# EAGLE design arpie2_display (EAGLE 6.6.0)
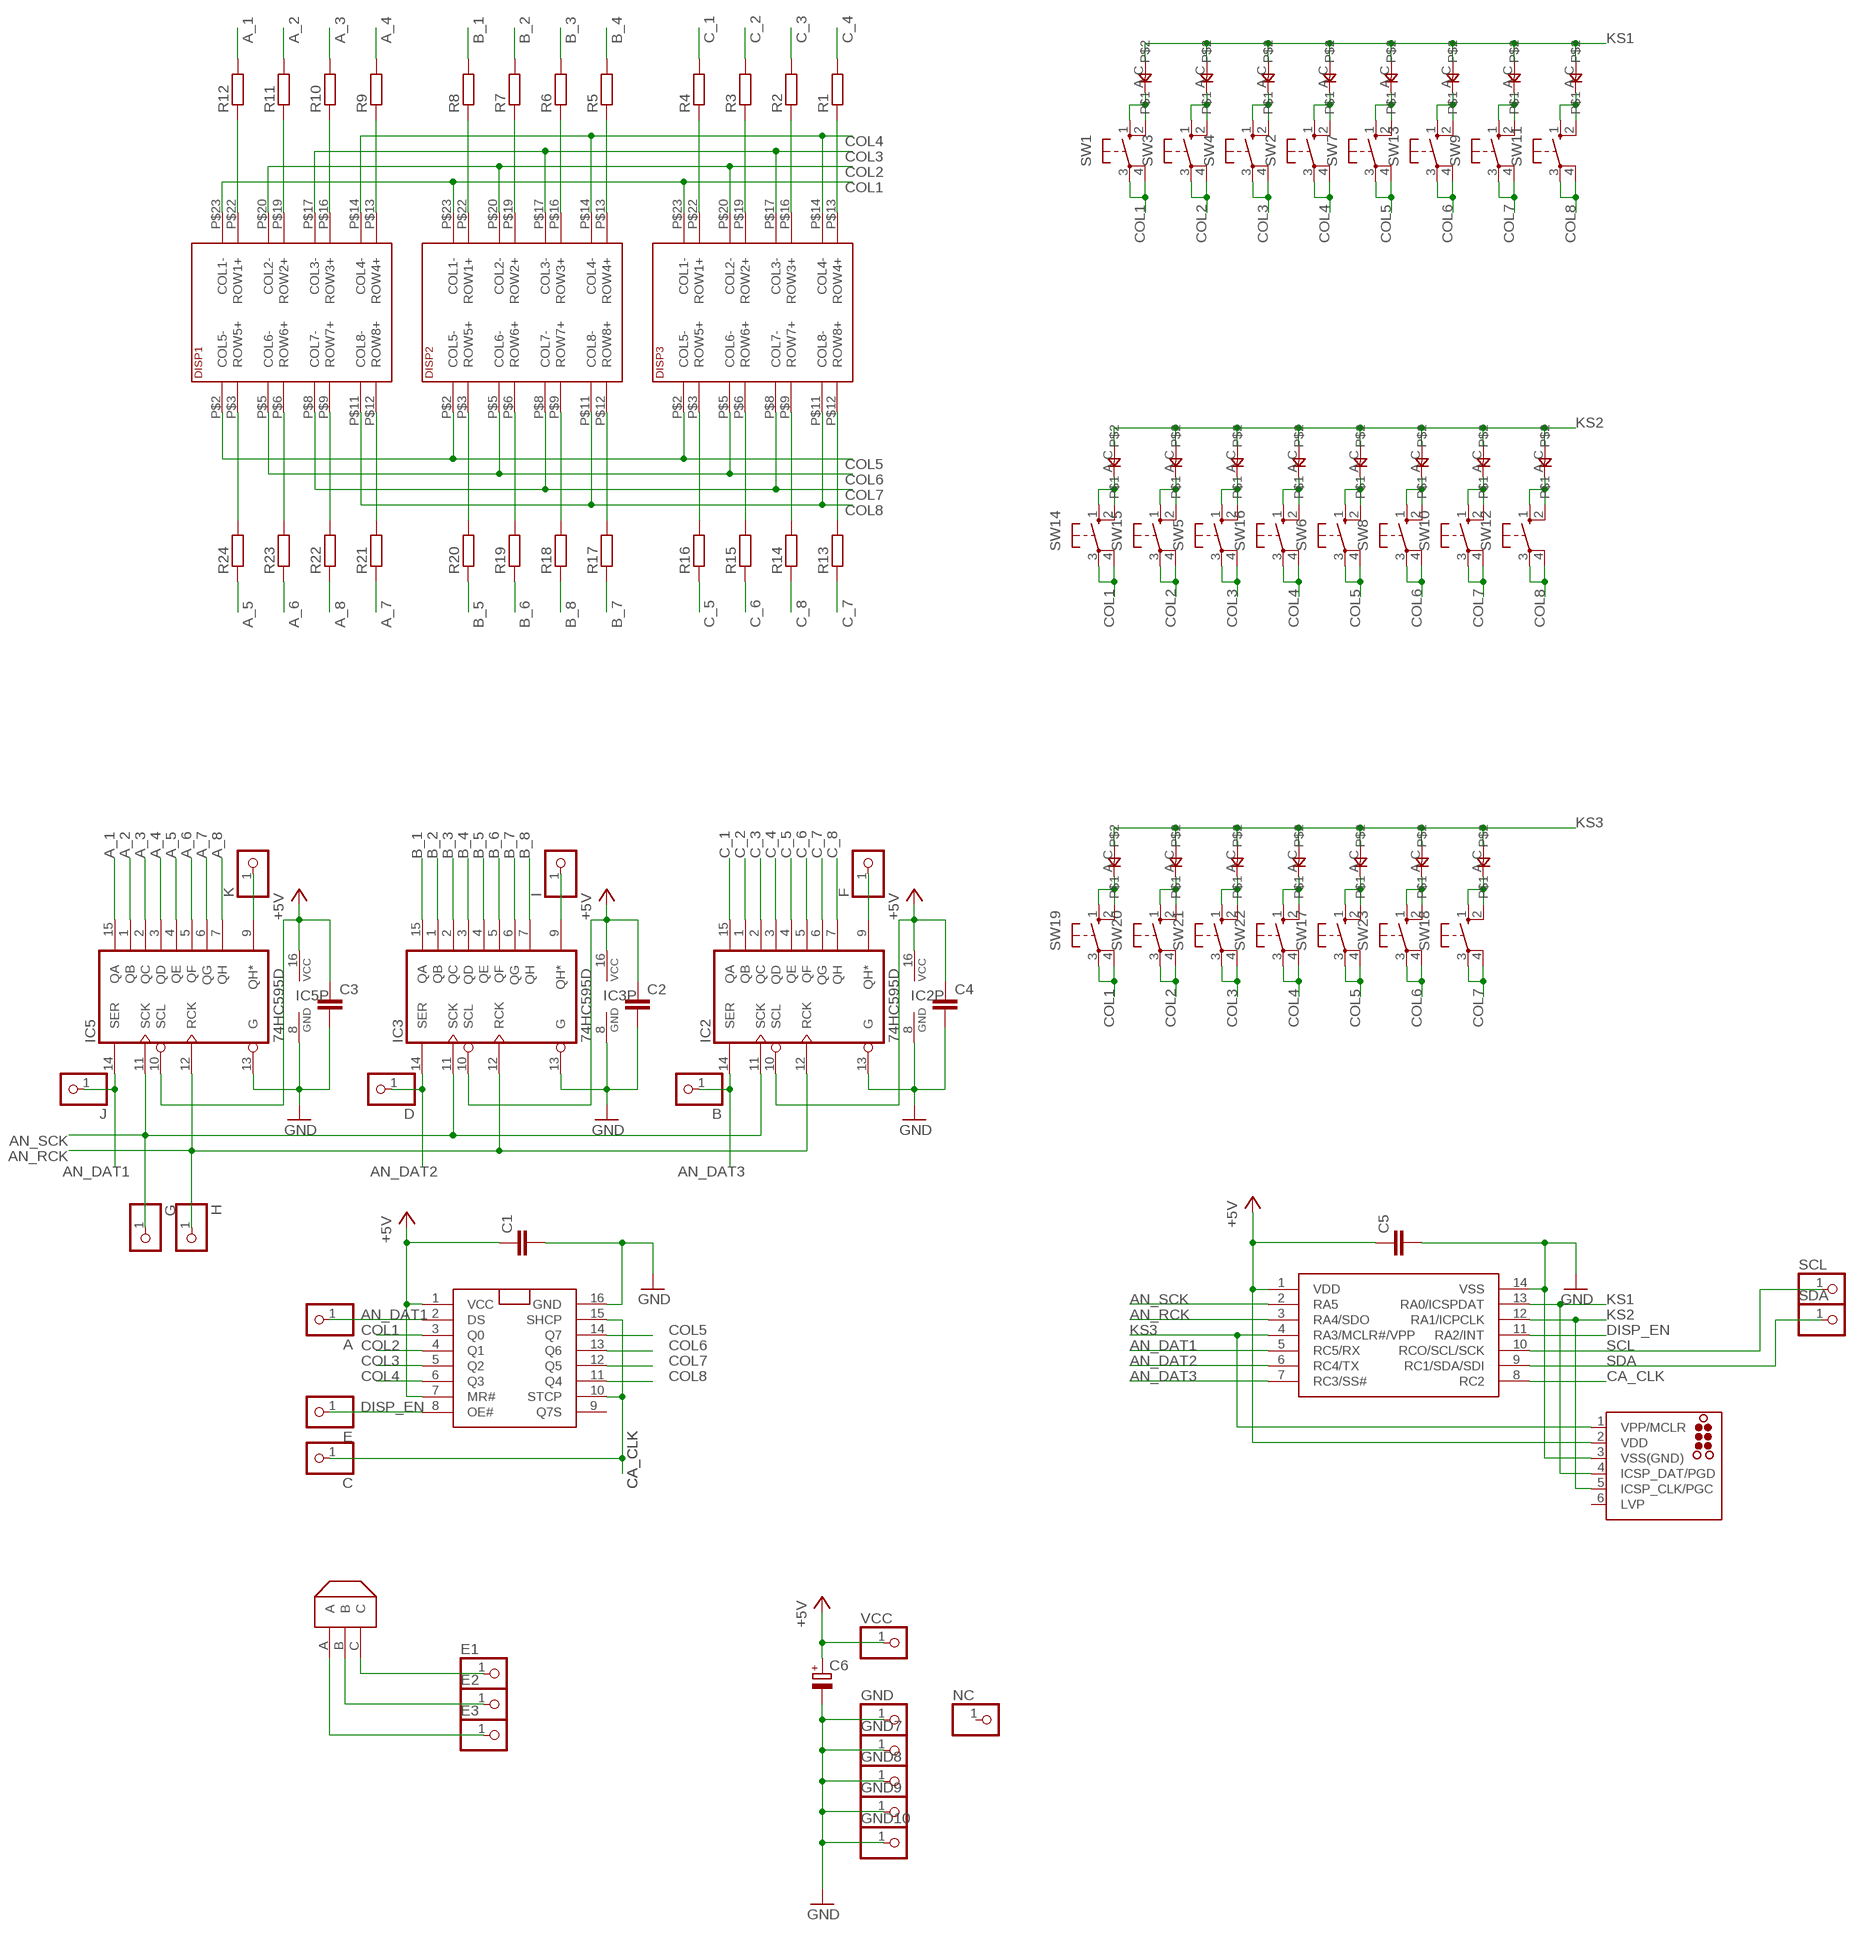
[diagram p0: schematic, sheet 1]

## Parts
A  PINHD-1X1  [1X01]
B  PINHD-1X1  [1X01]
C  PINHD-1X1  [1X01]
C1  C-EUC0805  [C0805]
C2  C-EUC0805  [C0805]
C3  C-EUC0805  [C0805]
C4  C-EUC0805  [C0805]
C5  C-EUC0805  [C0805]
C6  CPOL-EUE2,5-6E  [E2,5-6E]
D  PINHD-1X1  [1X01]
DISP1  1388BBMATRIX  [1388LEDMATRIX]
DISP2  1388BBMATRIX  [1388LEDMATRIX]
DISP3  1388BBMATRIX  [1388LEDMATRIX]
E  PINHD-1X1  [1X01]
E1  PINHD-1X1  [1X01]
E2  PINHD-1X1  [1X01]
E3  PINHD-1X1  [1X01]
ENC1  ENCODER  [ENCODER]
F  PINHD-1X1  [1X01]
G  PINHD-1X1  [1X01]
GND  PINHD-1X1  [1X01]
GND7  PINHD-1X1  [1X01]
GND8  PINHD-1X1  [1X01]
GND9  PINHD-1X1  [1X01]
GND10  PINHD-1X1  [1X01]
H  PINHD-1X1  [1X01]
I  PINHD-1X1  [1X01]
IC1  PIC16F1825SO14  [SO14]
IC2  74HC595D  [SO16]
IC3  74HC595D  [SO16]
IC4  NPIC6C596  [SO16]
IC5  74HC595D  [SO16]
ICSP  TC2030-MCP-NL  [TC2030-MCP-NL]
J  PINHD-1X1  [1X01]
K  PINHD-1X1  [1X01]
NC  PINHD-1X1  [1X01]
R1  R-EU_R0805  [R0805]
R2  R-EU_R0805  [R0805]
R3  R-EU_R0805  [R0805]
R4  R-EU_R0805  [R0805]
R5  R-EU_R0805  [R0805]
R6  R-EU_R0805  [R0805]
R7  R-EU_R0805  [R0805]
R8  R-EU_R0805  [R0805]
R9  R-EU_R0805  [R0805]
R10  R-EU_R0805  [R0805]
R11  R-EU_R0805  [R0805]
R12  R-EU_R0805  [R0805]
R13  R-EU_R0805  [R0805]
R14  R-EU_R0805  [R0805]
R15  R-EU_R0805  [R0805]
R16  R-EU_R0805  [R0805]
R17  R-EU_R0805  [R0805]
R18  R-EU_R0805  [R0805]
R19  R-EU_R0805  [R0805]
R20  R-EU_R0805  [R0805]
R21  R-EU_R0805  [R0805]
R22  R-EU_R0805  [R0805]
R23  R-EU_R0805  [R0805]
R24  R-EU_R0805  [R0805]
SCL  PINHD-1X1  [1X01]
SDA  PINHD-1X1  [1X01]
SW1  10-XX  [B3F-10XX]
SW2  10-XX  [B3F-10XX]
SW3  10-XX  [B3F-10XX]
SW4  10-XX  [B3F-10XX]
SW5  10-XX  [B3F-10XX]
SW6  10-XX  [B3F-10XX]
SW7  10-XX  [B3F-10XX]
SW8  10-XX  [B3F-10XX]
SW9  10-XX  [B3F-10XX]
SW10  10-XX  [B3F-10XX]
SW11  10-XX  [B3F-10XX]
SW12  10-XX  [B3F-10XX]
SW13  10-XX  [B3F-10XX]
SW14  10-XX  [B3F-10XX]
SW15  10-XX  [B3F-10XX]
SW16  10-XX  [B3F-10XX]
SW17  10-XX  [B3F-10XX]
SW18  10-XX  [B3F-10XX]
SW19  10-XX  [B3F-10XX]
SW20  10-XX  [B3F-10XX]
SW21  10-XX  [B3F-10XX]
SW22  10-XX  [B3F-10XX]
SW23  10-XX  [B3F-10XX]
U$2  0805DIODE  [0805DIODE]
U$3  0805DIODE  [0805DIODE]
U$4  0805DIODE  [0805DIODE]
U$5  0805DIODE  [0805DIODE]
U$6  0805DIODE  [0805DIODE]
U$7  0805DIODE  [0805DIODE]
U$8  0805DIODE  [0805DIODE]
U$9  0805DIODE  [0805DIODE]
U$10  0805DIODE  [0805DIODE]
U$11  0805DIODE  [0805DIODE]
U$12  0805DIODE  [0805DIODE]
U$13  0805DIODE  [0805DIODE]
U$14  0805DIODE  [0805DIODE]
U$15  0805DIODE  [0805DIODE]
U$16  0805DIODE  [0805DIODE]
U$17  0805DIODE  [0805DIODE]
U$18  0805DIODE  [0805DIODE]
U$19  0805DIODE  [0805DIODE]
U$20  0805DIODE  [0805DIODE]
U$21  0805DIODE  [0805DIODE]
U$22  0805DIODE  [0805DIODE]
U$23  0805DIODE  [0805DIODE]
U$24  0805DIODE  [0805DIODE]
VCC  PINHD-1X1  [1X01]

## Nets
+5V: C1.1 C2.1 C3.1 C4.1 C5.1 C6.+ IC1.1(VDD) IC2.10(SCL) IC2.16(VCC) IC3.10(SCL) IC3.16(VCC) IC4.1(VCC) IC4.7(MR#) IC5.10(SCL) IC5.16(VCC) ICSP.2(VDD) VCC.1
A_1: IC5.15(QA) R12.2
A_2: IC5.1(QB) R11.2
A_3: IC5.2(QC) R10.2
A_4: IC5.3(QD) R9.2
A_5: IC5.4(QE) R24.1
A_6: IC5.5(QF) R23.1
A_7: IC5.6(QG) R21.1
A_8: IC5.7(QH) R22.1
AN_DAT1: A.1 IC1.5(RC5/RX) IC4.2(DS) IC5.14(SER) J.1
AN_DAT2: D.1 IC1.6(RC4/TX) IC3.14(SER)
AN_DAT3: B.1 IC1.7(RC3/SS#) IC2.14(SER)
AN_RCK: H.1 IC1.3(RA4/SDO) IC2.12(RCK) IC3.12(RCK) IC5.12(RCK)
AN_SCK: G.1 IC1.2(RA5) IC2.11(SCK) IC3.11(SCK) IC5.11(SCK)
B_1: IC3.15(QA) R8.2
B_2: IC3.1(QB) R7.2
B_3: IC3.2(QC) R6.2
B_4: IC3.3(QD) R5.2
B_5: IC3.4(QE) R20.1
B_6: IC3.5(QF) R19.1
B_7: IC3.6(QG) R17.1
B_8: IC3.7(QH) R18.1
C_1: IC2.15(QA) R4.2
C_2: IC2.1(QB) R3.2
C_3: IC2.2(QC) R2.2
C_4: IC2.3(QD) R1.2
C_5: IC2.4(QE) R16.1
C_6: IC2.5(QF) R15.1
C_7: IC2.6(QG) R13.1
C_8: IC2.7(QH) R14.1
CA_CLK: C.1 IC1.8(RC2) IC4.10(STCP) IC4.15(SHCP)
COL1: DISP1.P$23(COL1-) DISP2.P$23(COL1-) DISP3.P$23(COL1-) IC4.3(Q0) SW1.3(P) SW1.4(P1) SW14.3(P) SW14.4(P1) SW19.3(P) SW19.4(P1)
COL2: DISP1.P$20(COL2-) DISP2.P$20(COL2-) DISP3.P$20(COL2-) IC4.4(Q1) SW3.3(P) SW3.4(P1) SW15.3(P) SW15.4(P1) SW20.3(P) SW20.4(P1)
COL3: DISP1.P$17(COL3-) DISP2.P$17(COL3-) DISP3.P$17(COL3-) IC4.5(Q2) SW4.3(P) SW4.4(P1) SW5.3(P) SW5.4(P1) SW21.3(P) SW21.4(P1)
COL4: DISP1.P$14(COL4-) DISP2.P$14(COL4-) DISP3.P$14(COL4-) IC4.6(Q3) SW2.3(P) SW2.4(P1) SW16.3(P) SW16.4(P1) SW22.3(P) SW22.4(P1)
COL5: DISP1.P$2(COL5-) DISP2.P$2(COL5-) DISP3.P$2(COL5-) IC4.14(Q7) SW6.3(P) SW6.4(P1) SW7.3(P) SW7.4(P1) SW17.3(P) SW17.4(P1)
COL6: DISP1.P$5(COL6-) DISP2.P$5(COL6-) DISP3.P$5(COL6-) IC4.13(Q6) SW8.3(P) SW8.4(P1) SW13.3(P) SW13.4(P1) SW23.3(P) SW23.4(P1)
COL7: DISP1.P$8(COL7-) DISP2.P$8(COL7-) DISP3.P$8(COL7-) IC4.12(Q5) SW9.3(P) SW9.4(P1) SW10.3(P) SW10.4(P1) SW18.3(P) SW18.4(P1)
COL8: DISP1.P$11(COL8-) DISP2.P$11(COL8-) DISP3.P$11(COL8-) IC4.11(Q4) SW11.3(P) SW11.4(P1) SW12.3(P) SW12.4(P1)
DISP_EN: E.1 IC1.11(RA2/INT) IC4.8(OE#)
GND: C1.2 C2.2 C3.2 C4.2 C5.2 C6.- GND7.1 GND8.1 GND9.1 GND10.1 GND.1 IC1.14(VSS) IC2.8(GND) IC2.13(G) IC3.8(GND) IC3.13(G) IC4.16(GND) IC5.8(GND) IC5.13(G) ICSP.3(VSS(GND))
KS1: IC1.13(RA0/ICSPDAT) ICSP.4(ICSP_DAT/PGD) U$2.C U$3.C U$4.C U$5.C U$6.C U$7.C U$8.C U$9.C
KS2: IC1.12(RA1/ICPCLK) ICSP.5(ICSP_CLK/PGC) U$10.C U$11.C U$12.C U$13.C U$14.C U$15.C U$16.C U$17.C
KS3: IC1.4(RA3/MCLR#/VPP) ICSP.1(VPP/MCLR) U$18.C U$19.C U$20.C U$21.C U$22.C U$23.C U$24.C
N$1: SW1.1(S) SW1.2(S1) U$2.A
N$2: SW14.1(S) SW14.2(S1) U$10.A
N$3: SW15.1(S) SW15.2(S1) U$11.A
N$4: SW3.1(S) SW3.2(S1) U$3.A
N$5: SW5.1(S) SW5.2(S1) U$12.A
N$6: SW16.1(S) SW16.2(S1) U$13.A
N$7: SW4.1(S) SW4.2(S1) U$4.A
N$8: SW6.1(S) SW6.2(S1) U$14.A
N$9: DISP1.P$22(ROW1+) R12.1
N$10: DISP1.P$19(ROW2+) R11.1
N$11: DISP1.P$16(ROW3+) R10.1
N$12: DISP1.P$13(ROW4+) R9.1
N$13: DISP2.P$22(ROW1+) R8.1
N$14: DISP2.P$19(ROW2+) R7.1
N$15: DISP2.P$16(ROW3+) R6.1
N$16: DISP2.P$13(ROW4+) R5.1
N$17: DISP3.P$22(ROW1+) R4.1
N$18: DISP3.P$19(ROW2+) R3.1
N$19: DISP3.P$16(ROW3+) R2.1
N$20: DISP3.P$13(ROW4+) R1.1
N$21: DISP1.P$3(ROW5+) R24.2
N$22: DISP1.P$6(ROW6+) R23.2
N$23: DISP1.P$9(ROW7+) R22.2
N$24: DISP1.P$12(ROW8+) R21.2
N$25: DISP2.P$3(ROW5+) R20.2
N$26: DISP2.P$6(ROW6+) R19.2
N$27: DISP2.P$9(ROW7+) R18.2
N$28: DISP2.P$12(ROW8+) R17.2
N$29: DISP3.P$3(ROW5+) R16.2
N$30: DISP3.P$6(ROW6+) R15.2
N$31: DISP3.P$9(ROW7+) R14.2
N$32: DISP3.P$12(ROW8+) R13.2
N$33: SW8.1(S) SW8.2(S1) U$15.A
N$34: SW2.1(S) SW2.2(S1) U$5.A
N$35: SW10.1(S) SW10.2(S1) U$16.A
N$36: SW12.1(S) SW12.2(S1) U$17.A
N$37: SW7.1(S) SW7.2(S1) U$6.A
N$38: SW19.1(S) SW19.2(S1) U$18.A
N$39: SW20.1(S) SW20.2(S1) U$19.A
N$40: SW13.1(S) SW13.2(S1) U$7.A
N$41: SW21.1(S) SW21.2(S1) U$20.A
N$42: SW22.1(S) SW22.2(S1) U$21.A
N$43: SW9.1(S) SW9.2(S1) U$8.A
N$44: SW17.1(S) SW17.2(S1) U$22.A
N$45: SW23.1(S) SW23.2(S1) U$23.A
N$46: SW11.1(S) SW11.2(S1) U$9.A
N$47: SW18.1(S) SW18.2(S1) U$24.A
N$48: E1.1 ENC1.C
N$49: E2.1 ENC1.B
N$50: E3.1 ENC1.A
N$51: IC5.9(QH*) K.1
N$52: I.1 IC3.9(QH*)
N$53: F.1 IC2.9(QH*)
SCL: IC1.10(RCO/SCL/SCK) SCL.1
SDA: IC1.9(RC1/SDA/SDI) SDA.1
Unconnected: IC4.9(Q7S) ICSP.6(LVP) NC.1

## Library data of the parts
A B C D E E1-E3 F G GND GND7-GND10 H I J K NC SCL SDA VCC = pinhead:PINHD-1X1: PIN HEADER
C1-C5 = resistor:C-EU: CAPACITOR, European symbol
C6 = rcl:CPOL-EU: POLARIZED CAPACITOR, European symbol
DISP1-DISP3 = jason_eagle6:1388BBMATRIX
ENC1 = jason_eagle6:ENCODER
IC1 = jasons_stuff:PIC16F1825
IC2 IC3 IC5 = 74xx-eu:74*595: 8-bit SHIFT REGISTER, output latch
IC4 = jasons_stuff:NPIC6C596
ICSP = tag-connect:TC2030: TAG-CONNECT ICSP Connector Manufacturer: Tag-Connect <http://www.tag-connect.com> Cable for easy In-Circuit Serial Programming. Designed for Microchip ICD2, suitable for many others. Two variants - one "with legs" (for hands-free fit on PCB) and another "without legs" for quick programming. PAD Description 1 MCLR/Vpp 2 Vdd 3 GND 4 PGD (ISPDAT) 5 PGC (ISPCLK) 6 nc (used for LVP) ©2009 ROFA.cz - modified and updated by Robert Darlington ‹rdarlington@gmail.com›
R1-R24 = rcl:R-EU_: RESISTOR, European symbol
SW1-SW23 = switch-omron:10-XX: OMRON SWITCH; MPN: B3F-1000; OC_FARNELL: 176432; OC_NEWARK: 36M3542
U$2-U$24 = jasons_stuff:0805DIODE

## Board
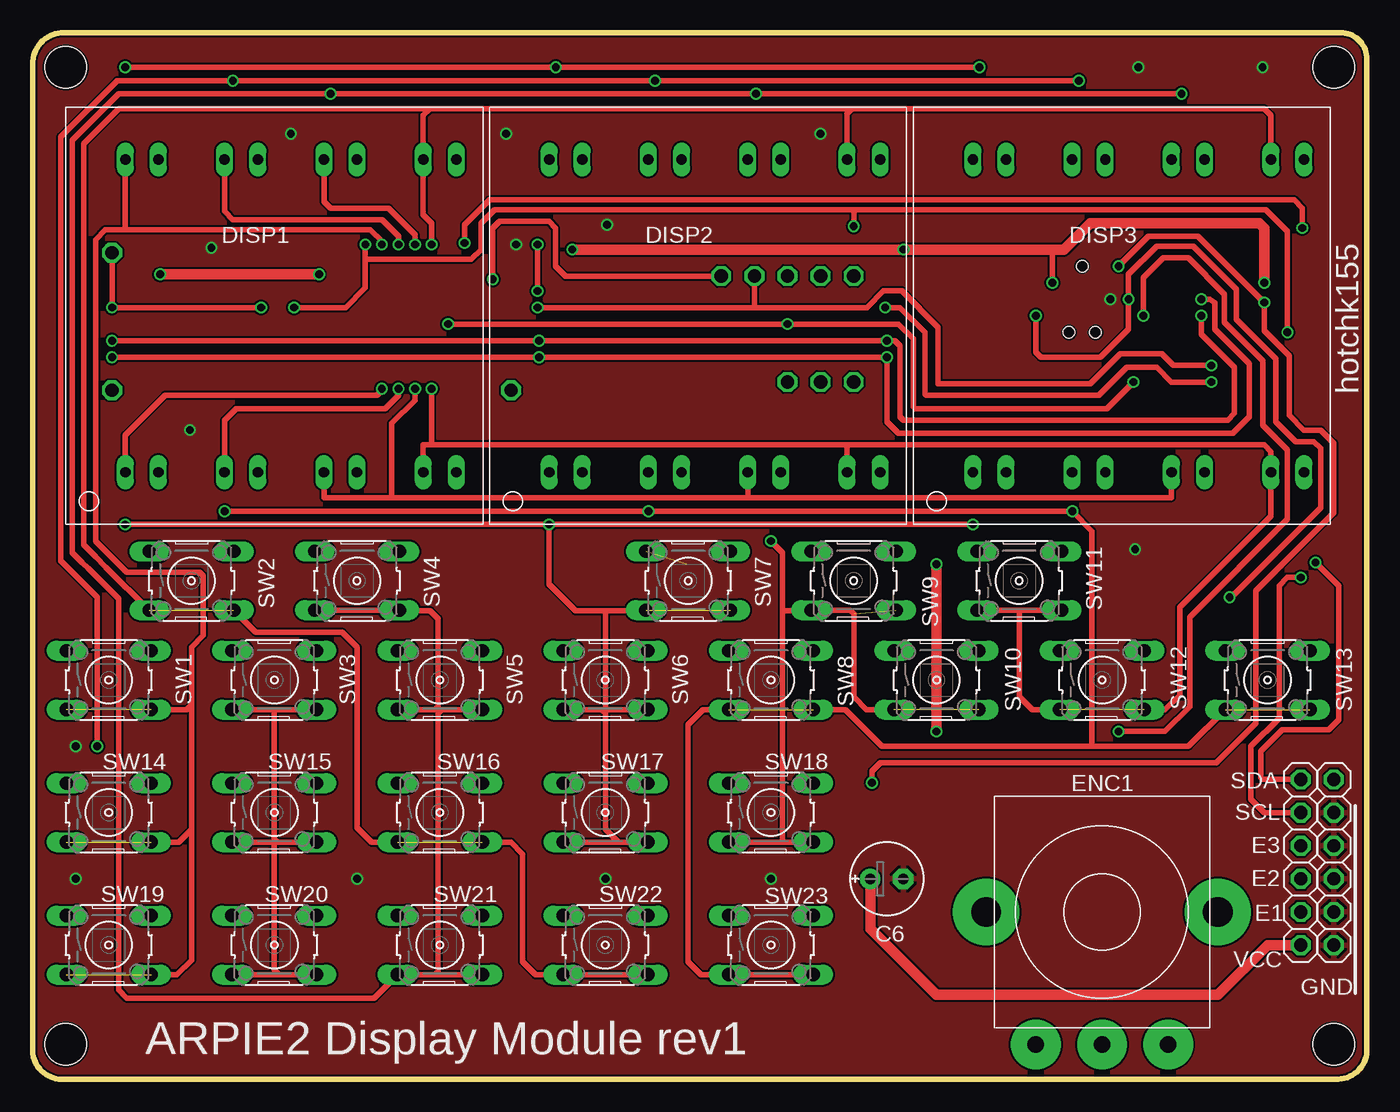
[diagram p1: board, top side]
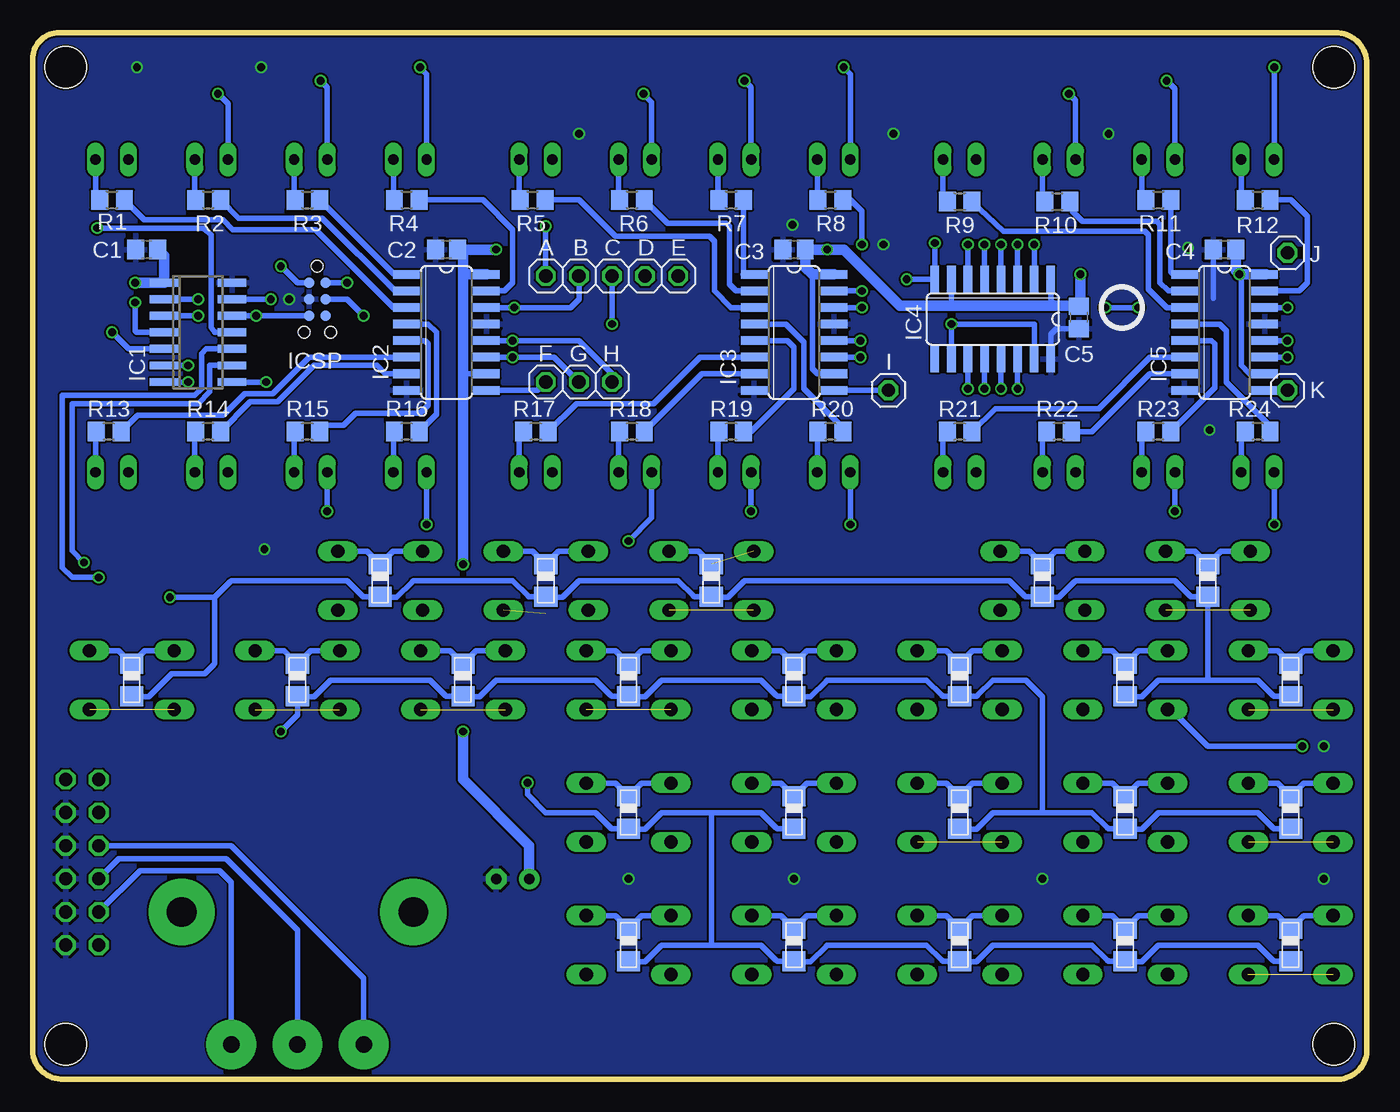
[diagram p2: board, bottom side, seen from below]

Size 102.36 x 80.27 mm. Coordinates in mm from the lower left corner, seen from the top.
Outline: 0,77.85 0,77.73 0,2.16 arc90 2.41,0 99.95,0 arc96 102.36,2.41 102.36,78.23 arc90 100.33,80.27 2.41,80.27 arc90 0,77.85
Copper layers (1*16): Top 0.035mm / dielectric 1.5mm / Bottom 0.035mm
Design rules "hackvana": minimum track width 6mil, minimum drill 0.3mm, track to track 6mil, track to pad 9mil, pad to pad 6mil, via to via 6mil, smd to smd 0mil, copper to edge 6mil, drill to drill 6mil, minimum pad ring 10mil, minimum via ring 6mil, stop-mask expansion 2mil, vias tented up to drill 100mil, thermal gap 10mil
Holes 3.2 mm at 99.82,77.6 2.54,77.6 2.54,2.67 99.82,2.67

### Footprints (pad centres in the part's own frame; a part is rotated, then mirrored left to right if it is on the bottom)
1X01 = drill 1.016 octagon: 1 0,0
C0805 = smd 1.3 x 1.5: 1 -0.85,0; 2 0.85,0
E2,5-6E = drill 0.813 pad 1.575: + -1.27,0 | drill 0.813 pad 1.575 octagon: - 1.27,0
1388LEDMATRIX = drill 0.8 long: P$2 -11.43,-12; P$3 -8.89,-12; P$5 -3.81,-12; P$6 -1.27,-12; P$8 3.81,-12; P$9 6.35,-12; P$11 11.43,-12; P$12 13.97,-12; P$13 13.97,12; P$14 11.43,12; P$16 6.35,12; P$17 3.81,12; P$19 -1.27,12; P$20 -3.81,12; P$22 -8.89,12; P$23 -11.43,12
ENCODER = drill 1.27 pad 3.81: A 5.08,10.16; B 0,10.16; C -5.08,10.16 | drill 2.286 pad 5.08: P$1 8.89,0; P$2 -8.89,0
SO14 = smd 0.6 x 2.2: 1 -3.81,-2.6; 2 -2.54,-2.6; 3 -1.27,-2.6; 4 0,-2.6; 5 1.27,-2.6; 6 2.54,-2.6; 7 3.81,-2.6; 8 3.81,2.6; 9 2.54,2.6; 10 1.27,2.6; 11 0,2.6; 12 -1.27,2.6; 13 -2.54,2.6; 14 -3.81,2.6
SO16 = smd 0.66 x 2.032: 1 -4.445,-3.073; 2 -3.175,-3.073; 3 -1.905,-3.073; 4 -0.635,-3.073; 5 0.635,-3.073; 6 1.905,-3.073; 7 3.175,-3.073; 8 4.445,-3.073; 9 4.445,3.073; 10 3.175,3.073; 11 1.905,3.073; 12 0.635,3.073; 13 -0.635,3.073; 14 -1.905,3.073; 15 -3.175,3.073; 16 -4.445,3.073
TC2030-MCP-NL = smd 0.787 x 0.787: 1 1.27,-0.635; 2 1.27,0.635; 3 2.54,-0.635; 4 2.54,0.635; 5 3.81,-0.635; 6 3.81,0.635 | hole 0.889: 0,0; 5.08,-1.016; 5.08,1.016
R0805 = smd 1.3 x 1.5: 1 -0.95,0; 2 0.95,0
B3F-10XX = drill 1.016 long: 1 -3.251,2.261; 2 3.251,2.261; 3 -3.251,-2.261; 4 3.251,-2.261
0805DIODE = smd 1.524 x 1.778: A -1.262,-0.005; C 1.238,-0.005

### Placement (x,y rotation side)
A  62.99,61.6 0 bottom
B  60.45,61.6 0 bottom
C  57.91,61.6 0 bottom
C1  93.6,63.63 180 bottom
C2  70.61,63.63 180 bottom
C3  43.94,63.63 180 bottom
C4  10.92,63.63 180 bottom
C5  22.1,58.42 270 bottom
C6  65.53,15.37 0 top
D  55.37,61.6 0 bottom
DISP1  18.54,58.55 0 top
DISP2  51.05,58.55 0 top
DISP3  83.57,58.55 0 top
E  52.83,61.6 0 bottom
E1  97.28,12.83 90 top
E2  97.28,15.37 90 top
E3  97.28,17.91 90 top
ENC1  82.04,12.83 180 top
F  62.99,53.47 0 bottom
G  60.45,53.47 0 bottom
GND  99.82,10.29 90 top
GND7  99.82,12.83 90 top
GND8  99.82,20.45 90 top
GND9  99.82,17.91 90 top
GND10  99.82,15.37 90 top
H  57.91,53.47 0 bottom
I  36.7,52.83 0 bottom
IC1  89.66,57.28 270 bottom
IC2  70.61,57.28 270 bottom
IC3  43.94,57.28 270 bottom
IC4  28.7,58.29 180 bottom
IC5  10.92,57.28 270 bottom
ICSP  80.52,62.36 270 bottom
J  6.1,63.37 0 bottom
K  6.1,52.83 0 bottom
NC  99.82,22.99 90 top
R1  96.27,67.44 0 bottom
R2  88.9,67.44 0 bottom
R3  81.28,67.44 0 bottom
R4  73.66,67.44 0 bottom
R5  64.01,67.44 0 bottom
R6  56.39,67.44 0 bottom
R7  48.77,67.44 0 bottom
R8  41.15,67.44 0 bottom
R9  31.24,67.31 0 bottom
R10  23.75,67.31 0 bottom
R11  16,67.44 0 bottom
R12  8.38,67.44 0 bottom
R13  96.52,49.66 180 bottom
R14  88.9,49.66 180 bottom
R15  81.28,49.66 180 bottom
R16  73.66,49.66 180 bottom
R17  63.75,49.66 180 bottom
R18  56.39,49.66 180 bottom
R19  48.77,49.66 180 bottom
R20  41.15,49.66 180 bottom
R21  31.24,49.66 180 bottom
R22  23.62,49.66 180 bottom
R23  16,49.66 180 bottom
R24  8.38,49.66 180 bottom
SCL  97.28,20.45 90 top
SDA  97.28,22.99 90 top
SW1  5.84,30.61 0 top
SW2  12.19,38.23 0 top
SW3  18.54,30.61 0 top
SW4  24.89,38.23 0 top
SW5  31.24,30.61 0 top
SW6  43.94,30.61 0 top
SW7  50.29,38.23 0 top
SW8  56.64,30.61 0 top
SW9  62.99,38.23 0 top
SW10  69.34,30.61 0 top
SW11  75.69,38.23 0 top
SW12  82.04,30.61 0 top
SW13  94.74,30.61 0 top
SW14  5.84,20.45 0 top
SW15  18.54,20.45 0 top
SW16  31.24,20.45 0 top
SW17  43.94,20.45 0 top
SW18  56.64,20.45 0 top
SW19  5.84,10.29 0 top
SW20  18.54,10.29 0 top
SW21  31.24,10.29 0 top
SW22  43.94,10.29 0 top
SW23  56.64,10.29 0 top
U$2  5.84,30.61 270 bottom
U$3  18.54,30.61 270 bottom
U$4  24.89,38.23 270 bottom
U$5  12.19,38.23 270 bottom
U$6  50.29,38.23 270 bottom
U$7  94.74,30.61 270 bottom
U$8  62.99,38.23 270 bottom
U$9  75.69,38.23 270 bottom
U$10  5.84,20.45 270 bottom
U$11  18.54,20.45 270 bottom
U$12  31.24,30.61 270 bottom
U$13  31.24,20.45 270 bottom
U$14  43.94,30.61 270 bottom
U$15  56.64,30.61 270 bottom
U$16  69.34,30.61 270 bottom
U$17  82.04,30.61 270 bottom
U$18  5.84,10.29 270 bottom
U$19  18.54,10.29 270 bottom
U$20  31.24,10.29 270 bottom
U$21  43.94,10.29 270 bottom
U$22  43.94,20.45 270 bottom
U$23  56.64,10.29 270 bottom
U$24  56.64,20.45 270 bottom
VCC  97.28,10.29 90 top

### Tracks (layer width: path | path; a pad name or v marks a point on that pad's centre or on a via)
+5V  (via drill 0.6)
  Top 0.406: v78.23,61.09 78.23,63.63
  Top 0.813: v9.78,61.72 v21.97,61.72 | v69.34,39.5 v69.34,26.67 | C6.+ 64.26,11.56 69.34,6.48 90.93,6.48 94.74,10.29 VCC.1 | v41.4,63.63 v66.8,63.63 78.23,63.63 79.12,63.63 81.15,65.66 94.11,65.66 94.49,65.28 v94.49,61.09
  Bottom 0.406: 7.87,61.75 IC5.16 | IC3.10 42.16,54.1 42.55,54.48 42.55,61.72 | IC5.10 9.02,54.1 9.65,54.74 9.65,61.94 10.07,62.36 | IC4.1 24.26,59.69 23.88,59.31 | IC4.7 31.88,59.44 31.75,59.31 | IC2.10 69.34,54.1 | ICSP.2 v78.23,61.09 | C5.1 22.31,59.27 22.35,59.31
  Bottom 0.813: C4.1 10.07,62.36 10.07,62.02 v9.78,61.72 IC5.16 7.75,61.72 | v21.97,61.72 21.97,59.4 C5.1 | IC3.16 42.55,61.72 43.05,62.23 43.05,63.59 C3.1 v41.4,63.63 40.13,63.63 35.81,59.31 31.75,59.31 23.88,59.31 22.35,59.31 22.1,59.31 | C6.+ 64.26,17.91 69.34,22.99 v69.34,26.67 | v69.34,39.5 69.34,54.1 69.34,61.72 | 69.34,61.72 69.34,63.21 C2.1 v66.8,63.63 | IC2.16 69.34,61.72 | v94.49,61.09 IC1.1 92.26,63.14 C1.1
A_1
  Bottom 0.406: R12.2 5.84,67.44 4.57,66.17 4.57,61.09 5.21,60.45 IC5.15
A_2
  Bottom 0.406: R11.2 15.05,61.92 14.86,61.72 IC5.1
A_3
  Bottom 0.406: IC5.2 15.24,60.45 15.88,61.09 15.88,65.53 16.13,65.79 21.84,65.79 22.61,66.55 22.61,67.88 R10.2
A_4
  Bottom 0.406: IC5.3 15.37,59.18 16.76,60.58 16.76,64.77 17.02,65.03 27.88,65.03 R9.2
A_5
  Bottom 0.406: R24.1 7.43,50.11 10.79,53.47 10.79,57.41 11.3,57.91 IC5.4
A_6
  Bottom 0.406: IC5.5 11.94,56.64 11.68,56.39 11.68,53.03 R23.1
A_7
  Bottom 0.406: IC5.6 16.64,55.37 20.57,51.44 28.51,51.44 R21.1
A_8
  Bottom 0.406: IC5.7 16.64,54.1 21.08,49.66 R22.1
AN_DAT1  (via drill 0.6)
  Top 0.406: 25.53,62.87 25.53,60.71 24,59.18 v20.07,59.18 | v25.53,64.01 25.53,62.87 | 25.53,62.87 33.66,62.87 34.42,63.63 34.42,65.66 35.43,66.68 62.99,66.68 | 62.99,66.68 94.61,66.68 96.27,65.03 v96.27,57.28 | v17.53,59.18 v6.1,59.18 J.1 | v62.99,65.41 62.99,66.68
  Bottom 0.406: IC5.14 v6.1,59.18 | IC4.2 v25.53,64.01 | IC1.5 95,56.01 v96.27,57.28 | v17.53,59.18 v20.07,59.18 | A.1 v62.99,65.41
AN_DAT2  (via drill 0.6)
  Top 0.406: v38.73,59.18 55.37,59.18 | 55.37,59.18 64.01,59.18 65.28,60.45 66.67,60.45 69.47,57.66 69.47,53.34 81.15,53.34 83.44,55.63 86.61,55.63 87.5,54.74 v90.42,54.74 | D.1 55.37,59.18
  Bottom 0.406: IC3.14 v38.73,59.18 | v90.42,54.74 IC1.6
AN_DAT3  (via drill 0.6)
  Top 0.406: v65.41,59.18 66.55,59.18 68.45,57.28 68.45,52.58 68.58,52.45 81.79,52.45 83.95,54.61 86.23,54.61 87.38,53.47 v90.42,53.47
  Bottom 0.406: IC2.14 v65.41,59.18 61.09,59.18 60.45,59.82 B.1 | v90.42,53.47 IC1.7
AN_RCK  (via drill 0.6)
  Top 0.406: v6.1,56.64 v38.86,56.64 v65.53,56.64 66.17,56.64 66.55,56.26 66.55,50.8 66.8,50.55 91.69,50.55 92.2,51.06 92.2,54.61 89.66,57.15 v89.66,58.55
  Bottom 0.406: IC5.12 v6.1,56.64 | IC3.12 v38.86,56.64 | IC2.12 v65.53,56.64 61.72,56.64 61.09,56.64 60.45,56.64 57.91,54.1 H.1 | IC1.3 v89.66,58.55
AN_SCK  (via drill 0.6)
  Top 0.406: v6.1,55.37 v38.86,55.37 v65.53,55.37 65.53,50.42 66.42,49.53 92.07,49.53 93.34,50.8 93.34,54.87 90.68,57.53 90.68,59.56 90.3,59.82 v89.66,59.82
  Bottom 0.406: IC5.11 v6.1,55.37 | IC3.11 v38.86,55.37 | IC2.11 v65.53,55.37 62.36,55.37 G.1 | IC1.2 v89.66,59.82
B_1  (via drill 0.6)
  Top 0.406: v38.73,60.45 v38.73,64.01
  Bottom 0.406: R8.2 39.62,67.44 38.73,66.55 v38.73,64.01 | IC3.15 v38.73,60.45
B_2
  Bottom 0.406: R7.2 47.82,61.78 47.88,61.72 IC3.1
B_3
  Bottom 0.406: IC3.2 48.39,60.45 48.9,60.96 48.9,65.41 49.15,65.66 53.66,65.66 R6.2
B_4
  Bottom 0.406: IC3.3 48.77,59.18 50.04,60.45 50.04,64.26 50.42,64.64 57.66,64.64 60.45,67.44 R5.2
B_5
  Bottom 0.406: IC3.4 44.58,57.91 43.18,56.52 43.18,52.96 40.2,49.98 R20.1
B_6
  Bottom 0.406: R19.1 47.24,49.66 43.94,52.96 43.94,56.14 44.45,56.64 IC3.5
B_7
  Bottom 0.406: IC3.6 51.18,55.37 54.74,51.82 60.65,51.82 R17.1
B_8
  Bottom 0.406: IC3.7 50.99,54.1 R18.1
C_1
  Bottom 0.406: IC2.15 66.17,60.45 65.53,61.09 65.53,65.15 67.82,67.44 R4.2
C_2
  Bottom 0.406: IC2.1 74.61,61.72 R3.2
C_3
  Bottom 0.406: IC2.2 74.55,60.45 80.14,66.04 86.55,66.04 R2.2
C_4
  Bottom 0.406: IC2.3 74.68,59.18 80.64,65.15 86.99,65.15 87.76,65.91 93.79,65.91 R1.2
C_5
  Bottom 0.406: IC2.4 72.01,57.91 71.37,57.28 71.37,50.99 R16.1
C_6
  Bottom 0.406: IC2.5 72.26,56.64 72.01,56.39 72.01,51.69 72.64,51.06 77.6,51.06 78.49,50.17 79.82,50.17 R15.1
C_7
  Bottom 0.406: R13.1 94.3,50.93 87.76,50.93 86.11,52.58 83.95,52.58 81.15,55.37 IC2.6
C_8
  Bottom 0.406: R14.1 85.66,51.94 83.57,51.94 80.77,54.74 75.95,54.74 75.31,54.1 IC2.7
CA_CLK  (via drill 0.6)
  Top 0.406: v31.88,57.91 v57.91,57.91 66.42,57.91 67.56,56.77 67.56,51.56 67.69,51.44 82.42,51.44 v84.45,53.47
  Bottom 0.406: IC4.15 25.53,57.91 v31.88,57.91 IC4.10 | v84.45,53.47 IC1.8 | C.1 v57.91,57.91
COL1  (via drill 0.6)  (3 unrouted)
  Top 0.406: v7.11,77.6 v40.13,77.6 v72.64,77.6 | v26.8,64.01 26.8,64.26 25.91,65.15 7.11,65.15 | 7.11,65.15 DISP1.P$23 | SW14.4 11.2,18.19 12.19,19.18 | SW1.4 11.84,28.35 12.19,28.7 | 12.19,28.7 12.19,33.15 13.08,34.04 13.08,38.61 12.83,38.86 7.24,38.86 4.83,41.28 4.83,64.39 5.59,65.15 7.11,65.15 | 12.19,28.7 12.19,19.18 | 12.19,19.18 12.19,9.15 11.05,8 9.12,8 SW19.4
  Bottom 0.406: DISP1.P$23 v7.11,77.6 | DISP2.P$23 39.62,77.09 v40.13,77.6 | DISP3.P$23 72.14,77.09 v72.64,77.6 | IC4.3 v26.8,64.01
COL2  (via drill 0.6)
  Top 0.406: 18.54,18.42 18.54,8.38 18.9,8.03 | SW15.4 18.88,18.19 | 18.88,18.19 arc-45 18.7,18.26 18.54,18.42 | SW20.4 18.9,8.03 | v80.26,76.58 v47.75,76.58 v15.37,76.58 6.48,76.58 2.16,72.26 2.16,39.75 4.95,36.96 v4.95,25.53 | v28.07,64.01 28.07,64.64 26.8,65.91 15.37,65.91 14.73,66.55 DISP1.P$20 | SW20.3 18.9,8.03 | SW15.3 18.88,18.19 | SW3.3 18.54,28.35 | 18.54,28.35 SW3.4 | 18.54,18.42 18.54,28.35
  Bottom 0.406: DISP1.P$20 14.73,75.95 v15.37,76.58 | DISP3.P$20 79.76,76.07 v80.26,76.58 | DISP2.P$20 47.24,76.07 v47.75,76.58 | IC4.4 v28.07,64.01 | SW3.3 15.01,28.35 12.19,25.53 v4.95,25.53
COL3  (via drill 0.6)
  Top 0.406: 30.89,8.03 SW21.3 26.19,6.22 7.24,6.22 6.6,6.86 6.6,36.83 4.26,39.18 3.81,39.63 3.05,40.39 3.05,72.01 6.6,75.57 v22.86,75.57 v55.5,75.57 v88.14,75.57 | 30.89,8.03 31.12,8.26 31.12,28.07 | 31.12,28.07 31.12,28.58 | 31.12,28.58 31.12,35.31 30.48,35.94 28.17,35.94 SW4.4 SW4.3 | SW5.3 30.89,28.35 31.12,28.58 | v29.34,64.01 29.34,64.77 27.3,66.8 22.86,66.8 22.35,67.31 DISP1.P$17 | SW21.4 30.89,8.03 | SW5.4 31.39,28.35 31.12,28.07
  Bottom 0.406: DISP1.P$17 22.35,75.06 v22.86,75.57 | DISP3.P$17 87.38,74.8 v88.14,75.57 | DISP2.P$17 54.86,74.93 v55.5,75.57 | IC4.5 v29.34,64.01
COL4  (via drill 0.6)  (2 unrouted)
  Top 0.406: SW16.4 34.52,18.16 36.7,18.16 37.59,17.27 37.59,9.02 38.58,8.03 SW22.3 SW22.4 | SW16.3 26.01,18.19 24.89,19.31 24.89,33.15 23.75,34.29 17.12,34.29 SW2.4 | 30.48,74.42 29.97,73.92 DISP1.P$14 29.97,66.3 30.61,65.66 v30.61,64.01 | 30.48,74.42 62.87,74.42 | 62.87,74.42 94.49,74.42 95,73.92 DISP3.P$14 | DISP2.P$14 62.48,74.04 62.87,74.42 | 30.48,74.42 6.6,74.42 3.94,71.76 3.94,40.97 4.83,40.08 5.63,39.28 SW2.3
  Bottom 0.406: IC4.6 v30.61,64.01
COL5  (via drill 0.6)  (1 unrouted)
  Top 0.406: SW17.4 44.93,18.19 | 44.93,18.19 43.94,19.18 43.94,28.07 | 43.94,28.07 43.94,35.94 | 43.94,35.94 47.02,35.94 SW7.3 | SW6.3 43.66,28.35 | 43.66,28.35 43.94,28.07 | v7.11,42.55 v39.62,42.55 | v39.62,42.55 v72.14,42.55 | v26.8,52.96 26.8,52.83 26.42,52.45 10.16,52.45 7.11,49.4 DISP1.P$2 | SW17.3 44.93,18.19 | SW6.4 43.66,28.35 | 43.94,35.94 41.66,35.94 39.62,37.97 v39.62,42.55
  Bottom 0.406: DISP1.P$2 v7.11,42.55 | DISP2.P$2 v39.62,42.55 | DISP3.P$2 v72.14,42.55 | IC4.14 v26.8,52.96
COL6  (via drill 0.6)  (2 unrouted)
  Top 0.406: 81.28,25.53 65.15,25.53 62.36,28.32 59.92,28.32 SW8.4 | 81.28,25.53 88.67,25.53 SW13.3 | 60.73,8.03 SW23.4 SW23.3 51.28,8.03 50.29,9.02 50.29,27.18 51.44,28.32 53.37,28.32 SW8.3 | v14.73,43.56 v47.24,43.56 v79.76,43.56 81.28,42.04 81.28,25.53 | v28.07,52.96 28.07,52.45 27.05,51.44 15.62,51.44 14.73,50.55 DISP1.P$5
  Bottom 0.406: DISP1.P$5 v14.73,43.56 | DISP2.P$5 v47.24,43.56 | DISP3.P$5 v79.76,43.56 | IC4.13 v28.07,52.96
COL7  (via drill 0.6)  (2 unrouted)
  Top 0.406: SW10.3 63.98,28.35 62.99,29.34 62.99,35.69 62.71,35.97 SW9.3 59.71,35.94 57.53,35.94 | 27.43,44.58 22.35,44.58 DISP1.P$8 | 27.43,44.58 54.74,44.58 | 54.74,44.58 87.38,44.58 DISP3.P$8 | DISP2.P$8 54.86,44.71 54.74,44.58 | v29.34,52.96 29.34,52.07 27.56,50.29 27.56,44.71 27.43,44.58 | SW18.3 SW18.4 57.56,18.19 57.53,18.16 57.53,35.94 | 57.53,35.94 57.53,40.39 v56.64,41.28
  Bottom 0.406: IC4.12 v29.34,52.96 | DISP2.P$8 54.86,43.05 v56.64,41.28
COL8  (via drill 0.6)  (1 unrouted)
  Top 0.406: DISP1.P$11 29.97,48.64 30.48,48.64 | 30.48,48.64 62.48,48.64 | 62.48,48.64 94.49,48.64 95,48.13 DISP3.P$11 95,43.18 88.01,36.2 88.01,29.47 86.87,28.32 85.32,28.32 SW12.4 | DISP2.P$11 62.48,48.64 | v30.61,52.96 30.61,48.77 30.48,48.64 | SW12.3 76.68,28.35 75.69,29.34 75.69,35.97 | SW11.3 75.69,35.97 | 75.69,35.97 SW11.4
  Bottom 0.406: IC4.11 v30.61,52.96
DISP_EN  (via drill 0.6)
  Top 0.406: v33.15,64.14 33.15,65.53 35.05,67.44 96.77,67.44 97.41,66.8 v97.41,65.28 | v35.31,61.34 35.31,65.28 35.81,65.79 39.62,65.79 40.13,65.28 40.13,62.36 40.89,61.6 E.1
  Bottom 0.406: v33.15,64.14 IC4.8 33.17,61.34 v35.31,61.34 | IC1.11 88.39,57.28 88.65,57.66 88.65,64.77 89.28,65.28 v97.41,65.28
GND  (via drill 0.6)
  Bottom 0.406: C5.2 23.84,57.57 24.26,57.15 IC4.16 | C4.2 11.77,59.91
  other vias: 3.3,15.37 3.3,25.53 24.89,15.37 43.94,15.37 56.64,15.37 19.81,72.52 36.32,72.52 60.45,72.52 37.08,64.01 94.36,77.6 84.84,77.6 84.58,40.64 82.68,59.82 13.72,63.76 12.06,49.79 44.07,65.53
  pour Bottom: -4.32,83.95 -4.32,-4.95 105.92,-4.95 106.17,-4.7 106.17,86.49 -4.06,86.49 -4.32,86.23
  pour Top: -1.78,82.68 -1.78,-3.68 106.17,-3.68 106.17,82.68
KS1  (via drill 0.6)
  Top 0.406: v91.82,36.96 91.95,36.96 98.81,43.82 98.81,48.39 98.3,48.9 96.9,48.9 95.38,50.42 95.38,55.25 92.33,58.29 92.33,60.58 89.03,63.88 86.23,63.88 84.07,61.72 v84.07,59.82 84.07,57.53 81.91,55.37 77.34,55.37 76.96,55.75 v76.96,58.55
  Bottom 0.406: U$2.C 7.04,29.37 arc45 7.22,29.44 8.38,30.61 12.19,30.61 | 12.19,30.61 15.9,30.61 arc-45 16.08,30.53 17.27,29.34 18.47,29.34 arc45 U$3.C | 12.19,30.61 U$5.C arc-45 U$5.C 13.39,36.99 arc45 13.57,37.06 14.73,38.23 22.25,38.23 arc-45 22.43,38.15 23.62,36.96 24.82,36.96 arc45 U$4.C 26.09,36.99 arc45 26.27,37.06 27.43,38.23 47.65,38.23 arc-45 47.83,38.15 49.02,36.96 50.22,36.96 arc45 U$6.C 51.49,36.99 arc45 51.67,37.06 52.83,38.23 60.35,38.23 arc-45 60.53,38.15 61.72,36.96 62.92,36.96 arc45 U$8.C 64.19,36.99 arc45 64.37,37.06 65.53,38.23 73.05,38.23 arc-45 73.23,38.15 74.42,36.96 75.62,36.96 arc45 U$9.C 76.89,36.99 arc45 77.07,37.06 78.23,38.23 87.02,38.23 arc-45 87.2,38.15 88.39,36.96 | 88.39,36.96 88.39,31.98 arc45 88.47,31.8 89.15,31.12 91.69,31.12 93.47,29.34 94.67,29.34 arc45 U$7.C | v91.82,36.96 88.39,36.96 | IC1.13 v84.07,59.82 | ICSP.4 78.23,59.82 v76.96,58.55
KS2  (via drill 0.6)
  Top 0.406: v83.31,26.67 86.87,26.67 88.77,28.58 88.77,35.43 96.27,42.93 96.27,48.26 94.36,50.17 94.36,55.12 91.44,58.04 91.44,60.2 88.65,62.99 86.74,62.99 85.22,61.47 v85.22,58.55
  Bottom 0.406: U$10.C 7.04,19.21 arc45 7.22,19.28 8.38,20.45 15.9,20.45 arc-45 16.08,20.37 17.27,19.18 18.47,19.18 arc45 U$11.C 19.74,19.21 arc45 19.92,19.28 21.08,20.45 24.89,20.45 | 24.89,20.45 28.6,20.45 arc-45 28.78,20.37 29.97,19.18 31.17,19.18 arc45 U$13.C | 24.89,20.45 24.89,29.34 26.09,30.53 arc-45 26.27,30.61 28.7,30.61 29.87,29.44 arc45 30.05,29.37 U$12.C 32.44,29.37 arc45 32.62,29.44 33.78,30.61 41.3,30.61 arc-45 41.48,30.53 42.67,29.34 43.87,29.34 arc45 U$14.C 45.14,29.37 arc45 45.32,29.44 46.48,30.61 54,30.61 arc-45 54.18,30.53 55.37,29.34 56.57,29.34 arc45 U$15.C 57.84,29.37 arc45 58.02,29.44 59.18,30.61 66.7,30.61 arc-45 66.88,30.53 68.07,29.34 69.27,29.34 arc45 U$16.C 70.54,29.37 arc45 70.72,29.44 71.88,30.61 79.4,30.61 arc-45 79.58,30.53 80.77,29.34 81.97,29.34 arc45 U$17.C 82.04,27.94 v83.31,26.67 | ICSP.5 v85.22,58.55 IC1.12
KS3  (via drill 0.6)
  Top 0.406: v64.39,22.73 64.39,23.62 65.02,24.26 90.8,24.26 93.85,27.31 93.85,37.47 99.82,43.44 99.82,48.77 98.81,49.79 97.54,49.79 96.39,50.93 96.39,55.5 94.49,57.41 v94.49,59.56 89.41,64.64 85.6,64.64 v83.31,62.36
  Bottom 0.406: U$18.C 7.04,9.05 arc45 7.22,9.12 8.38,10.29 15.9,10.29 arc-45 16.08,10.21 17.27,9.02 18.47,9.02 arc45 U$19.C 19.74,9.05 arc45 19.92,9.12 21.08,10.29 28.6,10.29 arc-45 28.78,10.21 29.97,9.02 31.17,9.02 arc45 U$20.C 32.44,9.05 arc45 32.62,9.12 33.78,10.29 41.3,10.29 arc-45 41.48,10.21 42.67,9.02 43.87,9.02 arc45 U$21.C 45.14,9.05 arc45 45.32,9.12 46.48,10.29 50.29,10.29 | 50.29,10.29 54,10.29 arc-45 54.18,10.21 55.37,9.02 56.57,9.02 arc45 U$23.C | U$22.C 45.14,19.21 arc45 45.32,19.28 46.48,20.45 50.29,20.45 | 50.29,20.45 54,20.45 arc-45 54.18,20.37 55.37,19.18 56.57,19.18 arc45 U$24.C 57.94,19.21 59.18,20.45 62.99,20.45 64.39,21.85 v64.39,22.73 | 50.29,10.29 50.29,20.45 | ICSP.1 82.04,61.09 v83.31,62.36 | v94.49,59.56 94.49,57.41 94.36,57.28 IC1.4
N$1
  Bottom 0.406: SW1.1 4.85,32.87 U$2.A 6.85,32.87 SW1.2
N$2
  Bottom 0.406: SW14.1 4.85,22.71 U$10.A 6.85,22.71 SW14.2
N$3
  Bottom 0.406: SW15.1 17.55,22.71 U$11.A 19.55,22.71 SW15.2
N$4
  Bottom 0.406: SW3.1 17.55,32.87 U$3.A 19.55,32.87 SW3.2
N$5
  Bottom 0.406: SW5.1 30.25,32.87 U$12.A 32.25,32.87 SW5.2
N$6
  Bottom 0.406: SW16.1 30.25,22.71 U$13.A 32.25,22.71 SW16.2
N$7
  Bottom 0.406: SW4.1 23.9,40.49 U$4.A 25.9,40.49 SW4.2
N$8
  Bottom 0.406: SW6.1 42.95,32.87 U$14.A 44.95,32.87 SW6.2
N$9
  Bottom 0.406: DISP1.P$22 9.65,67.76 R12.1
N$10
  Bottom 0.406: DISP1.P$19 17.27,67.76 R11.1
N$11
  Bottom 0.406: DISP1.P$16 24.89,67.5 R10.1
N$12
  Bottom 0.406: DISP1.P$13 32.51,67.63 R9.1
N$13
  Bottom 0.406: DISP2.P$22 42.16,67.5 R8.1
N$14
  Bottom 0.406: DISP2.P$19 49.78,67.5 R7.1
N$15
  Bottom 0.406: DISP2.P$16 57.4,67.5 R6.1
N$16
  Bottom 0.406: DISP2.P$13 65.02,67.5 R5.1
N$17
  Bottom 0.406: DISP3.P$22 74.68,67.5 R4.1
N$18
  Bottom 0.406: DISP3.P$19 82.3,67.5 R3.1
N$19
  Bottom 0.406: DISP3.P$16 89.92,67.5 R2.1
N$20
  Bottom 0.406: DISP3.P$13 97.54,67.76 R1.1
N$21
  Bottom 0.406: DISP1.P$3 9.65,49.66 R24.2
N$22
  Bottom 0.406: DISP1.P$6 17.27,49.34 R23.2
N$23
  Bottom 0.406: DISP1.P$9 24.89,49.34 R22.2
N$24
  Bottom 0.406: DISP1.P$12 32.51,49.34 R21.2
N$25
  Bottom 0.406: DISP2.P$3 42.16,49.59 R20.2
N$26
  Bottom 0.406: DISP2.P$6 49.78,49.59 R19.2
N$27
  Bottom 0.406: DISP2.P$9 57.4,49.59 R18.2
N$28
  Bottom 0.406: DISP2.P$12 65.02,49.34 R17.2
N$29
  Bottom 0.406: DISP3.P$3 74.68,49.59 R16.2
N$30
  Bottom 0.406: DISP3.P$6 82.3,49.59 R15.2
N$31
  Bottom 0.406: DISP3.P$9 89.92,49.59 R14.2
N$32
  Bottom 0.406: DISP3.P$12 97.54,49.59 R13.2
N$33
  Bottom 0.406: SW8.1 55.65,32.87 U$15.A 57.65,32.87 SW8.2
N$34
  Bottom 0.406: SW2.1 11.2,40.49 U$5.A 13.2,40.49 SW2.2
N$35
  Bottom 0.406: SW10.1 68.35,32.87 U$16.A 70.35,32.87 SW10.2
N$36
  Bottom 0.406: SW12.1 81.05,32.87 U$17.A 83.05,32.87 SW12.2
N$37  (1 unrouted)
  Bottom 0.406: SW7.2 51.3,40.49 U$6.A
N$38
  Bottom 0.406: SW19.1 4.85,12.55 U$18.A 6.85,12.55 SW19.2
N$39
  Bottom 0.406: SW20.1 17.55,12.55 U$19.A 19.55,12.55 SW20.2
N$40
  Bottom 0.406: SW13.1 93.75,32.87 U$7.A 95.75,32.87 SW13.2
N$41
  Bottom 0.406: SW21.1 30.25,12.55 U$20.A 32.25,12.55 SW21.2
N$42
  Bottom 0.406: SW22.1 42.95,12.55 U$21.A 44.95,12.55 SW22.2
N$43
  Bottom 0.406: SW9.1 62,40.49 U$8.A 64,40.49 SW9.2
N$44
  Bottom 0.406: SW17.1 42.95,22.71 U$22.A 44.95,22.71 SW17.2
N$45
  Bottom 0.406: SW23.1 55.65,12.55 U$23.A 57.65,12.55 SW23.2
N$46
  Bottom 0.406: SW11.1 74.7,40.49 U$9.A 76.7,40.49 SW11.2
N$47
  Bottom 0.406: SW18.1 55.65,22.71 U$24.A 57.65,22.71 SW18.2
N$48
  Bottom 0.406: ENC1.C 87.12,15.11 88.01,16 94.11,16 E1.1
N$49
  Bottom 0.406: ENC1.B 82.04,11.43 87.5,16.89 95.76,16.89 E2.1
N$50
  Bottom 0.406: ENC1.A 76.96,7.75 87.12,17.91 E3.1
N$51
  Bottom 0.406: IC5.9 K.1
N$52
  Bottom 0.406: IC3.9 I.1
N$53
  Bottom 0.406: IC2.9 63.63,52.83 F.1
SCL  (via drill 0.6)
  Top 0.406: SCL.1 94.49,20.45 93.47,21.46 93.47,25.53 95.63,27.69 95.63,37.85 96.27,38.48 v97.28,38.48
  Bottom 0.406: IC1.10 89.03,56.01 89.41,55.63 89.41,52.96 89.92,52.45 100.08,52.45 100.08,39.24 99.31,38.48 v97.28,38.48
SDA  (via drill 0.6)
  Top 0.406: SDA.1 94.36,22.99 94.23,23.12 94.23,25.15 95.88,26.8 99.44,26.8 100.2,27.56 100.2,37.85 v98.42,39.63
  Bottom 0.406: IC1.9 88.77,54.74 88.77,52.71 89.66,51.82 99.31,51.82 99.31,40.51 v98.42,39.63

### Text on the board
tPlace: GND
tNames: hotchk155 | ARPIE2 Display Module rev1